# Altium schematic sheet KEY_RAW_SCH.SchDoc
size A4; SheetNumber: 1; SheetTotal: 3
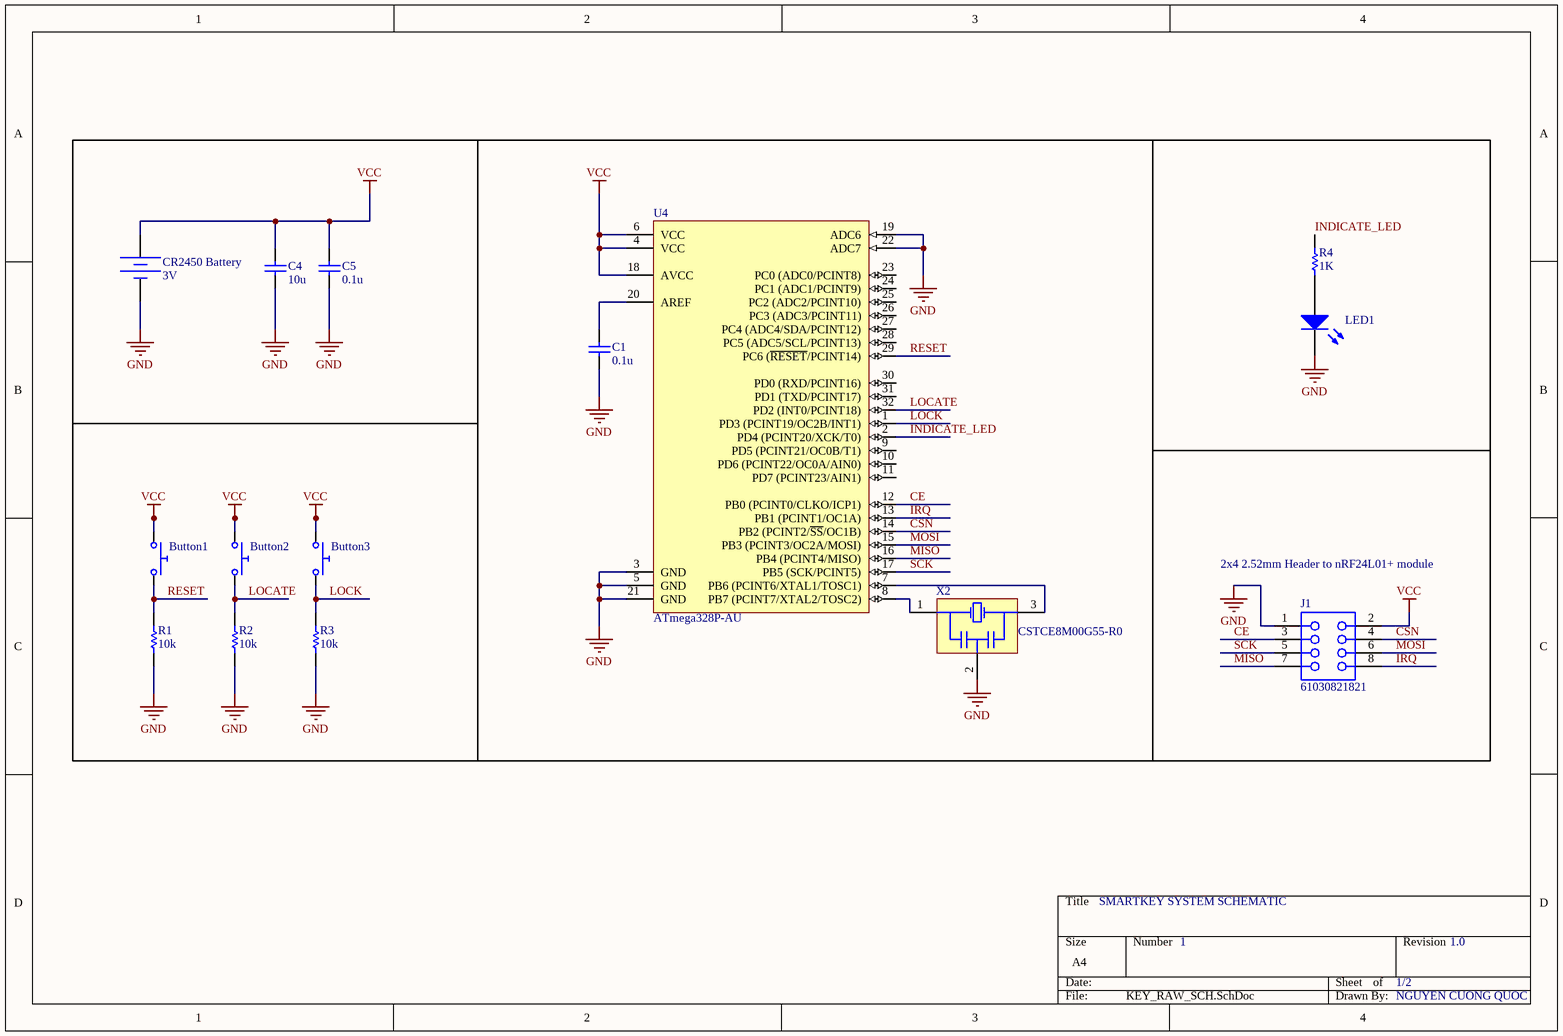
[diagram p0: KEY_RAW_SCH.SchDoc]

## Parts
Button1  Push Button Normally Opened  (value not drawn)
Button2  Push Button Normally Opened  (value not drawn)
Button3  Push Button Normally Opened  (value not drawn)
C1  value 0.1u  (hidden comment: Capacitor)
C4  value 10u  (hidden comment: Capacitor)
C5  value 0.1u  (hidden comment: Capacitor)
CR2450_Battery  DC Magnitude: 3V  (hidden comment: Constant Voltage Source)
J1  61030821821  [61030821821]
LED1  Light-Emitting Diode  (value not drawn)
R1  value 10k  (hidden comment: Resistor)
R2  value 10k  (hidden comment: Resistor)
R3  value 10k  (hidden comment: Resistor)
R4  value 1K  (hidden comment: Resistor)
U4  ATmega328P-AU  [32A_M]
X2  CSTCE8M00G55-R0  [MURA-CSTCE_G_A-3_V]

## Nets
GND: C1.1 C4.1 C5.1 CR2450_Battery.2 J1.1 LED1.2(K) R1.1 R2.1 R3.1 U4.3(GND) U4.5(GND) U4.19(ADC6) U4.21(GND) U4.22(ADC7) X2.2(GND)
VCC: Button1.1 Button2.1 Button3.1 C4.2 C5.2 CR2450_Battery.1 J1.2 U4.4(VCC) U4.6(VCC) U4.18(AVCC)
CE: J1.3 U4.12(PB0_(PCINT0/CLKO/ICP1))
CSN: J1.4 U4.14(PB2_(PCINT2/~{SS}/OC1B))
INDICATE_LED: R4.2 U4.2(PD4_(PCINT20/XCK/T0))
IRQ: J1.8 U4.13(PB1_(PCINT1/OC1A))
LOCATE: Button2.2 R2.2 U4.32(PD2_(INT0/PCINT18))
LOCK: Button3.2 R3.2 U4.1(PD3_(PCINT19/OC2B/INT1))
MISO: J1.7 U4.16(PB4_(PCINT4/MISO))
MOSI: J1.6 U4.15(PB3_(PCINT3/OC2A/MOSI))
RESET: Button1.2 R1.2 U4.29(PC6_(~{RESET}/PCINT14))
SCK: J1.5 U4.17(PB5_(SCK/PCINT5))
NetC1_2: C1.2 U4.20(AREF)
NetLED1_1: LED1.1(A) R4.1
NetU4_7: U4.7(PB6_(PCINT6/XTAL1/TOSC1)) X2.3(X2)
NetU4_8: U4.8(PB7_(PCINT7/XTAL2/TOSC2)) X2.1(X1)

Not connected (* = marked no-connect by the designer): U4 9(PD5_(PCINT21/OC0B/T1)) 10(PD6_(PCINT22/OC0A/AIN0)) 11(PD7_(PCINT23/AIN1)) 23(PC0_(ADC0/PCINT8)) 24(PC1_(ADC1/PCINT9)) 25(PC2_(ADC2/PCINT10)) 26(PC3_(ADC3/PCINT11)) 27(PC4_(ADC4/SDA/PCINT12)) 28(PC5_(ADC5/SCL/PCINT13)) 30(PD0_(RXD/PCINT16)) 31(PD1_(TXD/PCINT17))

## Notes on the sheet
- 2x4 2.52mm Header to nRF24L01+ module
- SMARTKEY SYSTEM SCHEMATIC
- 1
- 1/2
- 1.0
- NGUYEN CUONG QUOC

## Library data of the parts
Button1-Button3 = Push Button NO: closed: 0; Rclosed: 1m; Ropen: 1Meg; SimulationGenericComponent: True
C1 C4 C5 = Capacitor: SimulationGenericComponent: True
CR2450_Battery = Battery: SimulationGenericComponent: True
J1 = CMP-1502-01304-3: NexarPartId: 89205501; Gender: Female; Current Rating: 3A; Operating Supply Voltage: 250V; Contact Resistance: 20mΩ; Orientation: Vertical; RoHS: Non-Compliant; Number of Pins: 8; Packaging: Tape and Reel; Lead Pitch: 2.54mm
LED1 = LED: AF: 1; BV: 0; BV_MAX: 1e99; EG: 1.11; FC: 0.5; IBV: 0.001; IS: 1e-14; MJSW: 0.33; NTUN: 30; TNOM: 27; XTI: 3; SimulationGenericComponent: True; CJO: 0; CJP: 0; CTA: 0; CTP: 0; FCS: 0.5; FV_MAX: 1e99; IKF: 0; IKR: 0; ISR: 1e-14; JSW: 0; JTUN: 0; JTUNSW: 0; KEG: 1; KF: 0; LEVEL: 1; N: 1; NBV: 1; NR: 1; NS: 1; PHP: 1; RS: 0; TCV: 0; TLEV: 0; TLEVC: 0; TM1: 0; TM2: 0; TPB: 0; TPHP: 0; TRS: 0; TRS2: 0; TT: 0; TTT1: 0; TTT2: 0; VJ: 1; XTITUN: 3
R1-R4 = Resistor: TC1: 0; SimulationGenericComponent: True; TC2: 0
U4 = CMP-0095-00269-2: 8-bit AVR Microcontroller, 32KB Flash, 1KB EEPROM, 2KB SRAM, 32-pin TQFP, Industrial Grade (-40°C to 85°C); PackageDescription: 32-Lead, 7x7x1.0 mm Body, 0.8mm Lead Pitch, Thin Profile Plastic Quad Flat Package (TQFP); DatasheetVersion: revD, May-2011; RevisionNote: DatasheetVersion & PackageVersion updated. URLs added.; ComponentLink1URL: http://www.atmel.com/; ComponentLink2Description: ATmega48A/48PA/88A/88PA/168A/168PA/328/328P Datasheet; Code_JEDEC: MS-026-ABA; ComponentLink1Description: Manufacturer URL; PackageReference: 32A; ComponentLink3Description: ATmega48A/48PA/88A/88PA/168A/168PA/328/328P Summary; ComponentLink2URL: http://www.atmel.com/dyn/resources/prod_documents/doc8271.pdf; PackageVersion: revC, Oct-2010; ComponentLink3URL: http://www.atmel.com/dyn/resources/prod_documents/8271S.pdf
X2 = CMP-2100-03620-1: Ceramic Resonator, 8 MHz, +/- 0.5%, -20 to 80 degC, 3-Pin SMD, RoHS, Tape and Reel; Manufacturer: Murata; Capacitance: 33pF; Frequency Stability: 0.2%; Self Resonant Frequency: 8MHz; Datasheet Version: 42339.0; RoHSCompliant: True; Datasheet URL: http://www.murata.com/~/media/webrenewal/support/library/catalog/products/timingdevice/ceralock/p16e.ashx; Case/Package: Ceramic; Load Capacitance: 33pF; Tolerance: 0.5%; Mount: SurfaceMount; Height: 0.031inch; Number of Pins: 3; Package Description: 3-Pin Surface Mount Device, Body 3.2 x 1.3 mm, Pitch 1.2 mm; Package Quantity: 1; Lead Free: LeadFree; Contact Plating: Gold; REACH SVHC: NoSVHC; Length: 0.126inch; Width: 0.051inch; Manufacturer URL: http://www.murata.com/; Packaging: TapeandReel; Termination: SMD/SMT; Frequency Tolerance: 0.5%; Max Operating Temperature: 80degC; Composition: Ceramic; Package Reference: CSTCE_G_A-3; Min Operating Temperature: -20degC; Frequency: 8MHz